# EAGLE design Schematic_v2 (EAGLE 9.4.0)
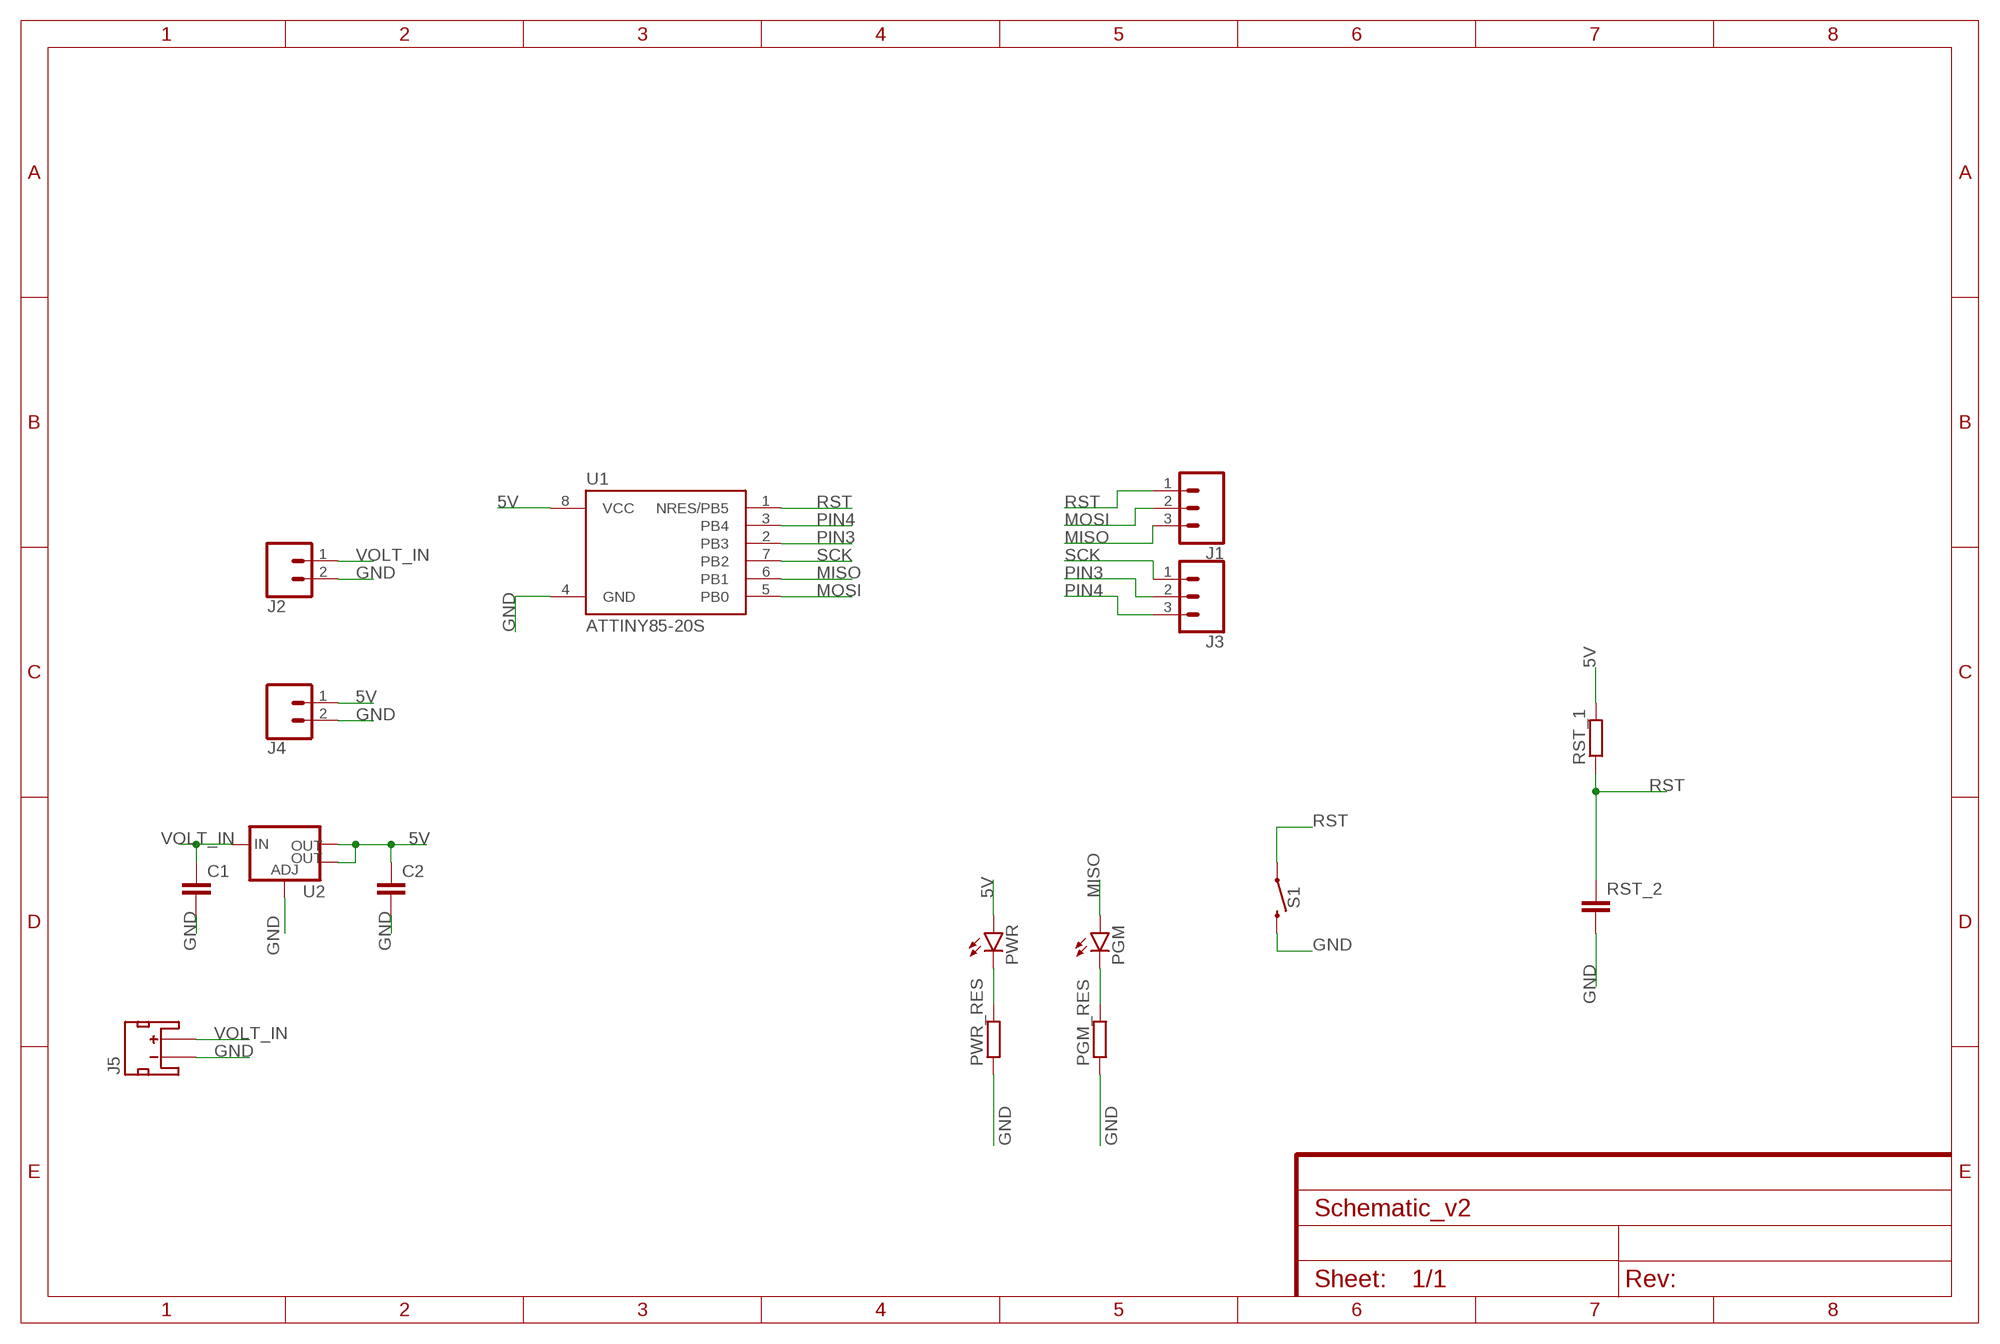
[diagram p0: schematic, sheet 1]

## Parts
C1  C-EUC0805  [C0805]
C2  C-EUC0805  [C0805]
J1  CONN_031X03_NO_SILK  [1X03_NO_SILK]
J2  CONN_021X02_NO_SILK  [1X02_NO_SILK]
J3  CONN_031X03_NO_SILK  [1X03_NO_SILK]
J4  CONN_021X02_NO_SILK  [1X02_NO_SILK]
J5  JST_2MM_MALE  [JST-2-SMD]
PGM  LEDSML0805  [SML0805]
PGM_RES  R-EU_R0805  [R0805]
PWR  LEDSML0805  [SML0805]
PWR_RES  R-EU_R0805  [R0805]
RST_1  R-EU_R0805  [R0805]
RST_2  C-EUC0805  [C0805]
S1  MOMENTARY-SWITCH-SPST-SMD-6.0X3.5MM  [TACTILE_SWITCH_SMD_6.0X3.5MM]
U1  ATTINY85-20S  [SOIC8_EIAJ_208MIL]
U2  V_REG_LM1117SOT223  [SOT223]

## Nets
5V: C2.1 J4.1 PWR.A RST_1.2 U1.8(VCC) U2.2(OUT) U2.4(OUT)
GND: C1.2 C2.2 J2.2 J4.2 J5.1(-) PGM_RES.1 PWR_RES.1 RST_2.2 S1.2 U1.4(GND) U2.1(ADJ)
MISO: J1.3 PGM.A U1.6(PB1)
MOSI: J1.2 U1.5(PB0)
N$1: PWR.C PWR_RES.2
N$3: PGM.C PGM_RES.2
PIN3: J3.2 U1.2(PB3)
PIN4: J3.3 U1.3(PB4)
RST: J1.1 RST_1.1 RST_2.1 S1.1 U1.1(NRES/PB5)
SCK: J3.1 U1.7(PB2)
VOLT_IN: C1.1 J2.1 J5.2(+) U2.3(IN)
Unconnected: J5.NC1(PAD1) J5.NC2(PAD2)

## Library data of the parts
C1 C2 RST_2 = rcl:C-EU: CAPACITOR, European symbol; SPICEPREFIX: C
J1 J3 = SparkFun-Connectors:CONN_03: Multi connection point. Often used as Generic Header-pin footprint for 0.1 inch spaced/style header connections On any of the 0.1 inch spaced packages, you can populate with these: Break Away Headers - Straight <https://www.sparkfun.com/products/116> (PRT-00116) Break Away Male Headers - Right Angle <https://www.sparkfun.com/products/553> (PRT-00553) Female Headers <https://www.sparkfun.com/products/115> (PRT-00115) Break Away Headers - Machine Pin <https://www.sparkfun.com/products/117> (PRT-00117) Break Away Female Headers - Swiss Machine Pin <https://www.sparkfun.com/products/743> (PRT-00743) Stackable Header - 3 Pin (Female, 0.1") <https://www.sparkfun.com/products/13875> (PRT-13875) For SCREWTERMINALS and SPRING TERMINALS visit here: Screw Terimnals on SparkFun.com <https://www.sparkfun.com/search/results?term=Screw+Terminals> (5mm/3.5mm/2.54mm spacing) This device is also useful as a general connection point to wire up your design to another part of your project. Our various solder wires solder well into these plated through hole pads. Hook-Up Wire - Assortment (Stranded, 22 AWG) <https://www.sparkfun.com/products/11375> (PRT-11375) Hook-Up Wire - Assortment (Solid Core, 22 AWG) <https://www.sparkfun.com/products/11367> (PRT-11367) View the entire wire category on our website here <https://www.sparkfun.com/categories/141> Special notes: Molex polarized connector foot print use with SKU : PRT-08232 with associated crimp pins and housings.
J2 J4 = SparkFun-Connectors:CONN_02: Multi connection point. Often used as Generic Header-pin footprint for 0.1 inch spaced/style header connections On any of the 0.1 inch spaced packages, you can populate with these: Break Away Headers - Straight <https://www.sparkfun.com/products/116> (PRT-00116) Break Away Male Headers - Right Angle <https://www.sparkfun.com/products/553> (PRT-00553) Female Headers <https://www.sparkfun.com/products/115> (PRT-00115) Break Away Headers - Machine Pin <https://www.sparkfun.com/products/117> (PRT-00117) Break Away Female Headers - Swiss Machine Pin <https://www.sparkfun.com/products/743> (PRT-00743) For SCREWTERMINALS and SPRING TERMINALS visit here: Screw Terimnals on SparkFun.com <https://www.sparkfun.com/search/results?term=Screw+Terminals> (5mm/3.5mm/2.54mm spacing) This device is also useful as a general connection point to wire up your design to another part of your project. Our various solder wires solder well into these plated through hole pads. Hook-Up Wire - Assortment (Stranded, 22 AWG) <https://www.sparkfun.com/products/11375> (PRT-11375) Hook-Up Wire - Assortment (Solid Core, 22 AWG) <https://www.sparkfun.com/products/11367> (PRT-11367) View the entire wire category on our website here <https://www.sparkfun.com/categories/141> Special notes: Molex polarized connector foot print use with: PRT-08233 with associated crimp pins and housings. 2.54_SCREWTERM for use with PRT-10571. 3.5mm Screw Terminal footprints for PRT-08084 5mm Screw Terminal footprints for use with PRT-08432
J5 = SparkFun-Connectors:JST_2MM_MALE: JST 2MM MALE RA CONNECTOR Two pin, compact surface mount connector. Commonly used as a battery input connection point. We really like the solid locking feeling and high current rating on these small connectors. We use these all the time as battery connectors. Mates to single-cell LiPo batteries. Here is the connector we sell at SparkFun: JST Right Angle Connector - White <https://www.sparkfun.com/products/8612> (PRT-08612) Datasheet <http://www.sparkfun.com/datasheets/Prototyping/Connectors/JST-Horizontal.pdf> It was used on these SparkFun products: SparkFun MOSFET Power Controller <https://www.sparkfun.com/products/11214> (PRT-11214) SparkFun Battery Babysitter - LiPo Battery Manager <https://www.sparkfun.com/products/13777> (PRT-13777) And many, many others that required a lipo battery connection.; PROD_ID: CONN-11443; SF_ID: PRT-08612
PGM PWR = led:LED: LED OSRAM: - CHIPLED LG R971, LG N971, LY N971, LG Q971, LY Q971, LO R971, LY R971 LH N974, LH R974 LS Q976, LO Q976, LY Q976 LO Q996 - Hyper CHIPLED LW Q18S LB Q993, LB Q99A, LB R99A - SideLED LS A670, LO A670, LY A670, LG A670, LP A670 LB A673, LV A673, LT A673, LW A673 LH A674 LY A675 LS A676, LA A676, LO A676, LY A676, LW A676 LS A679, LY A679, LG A679 - Hyper Micro SIDELED® LS Y876, LA Y876, LO Y876, LY Y876 LT Y87S - SmartLED LW L88C, LW L88S LB L89C, LB L89S, LG L890 LS L89K, LO L89K, LY L89K LS L896, LA L896, LO L896, LY L896 - TOPLED LS T670, LO T670, LY T670, LG T670, LP T670 LSG T670, LSP T670, LSY T670, LOP T670, LYG T670 LG T671, LOG T671, LSG T671 LB T673, LV T673, LT T673, LW T673 LH T674 LS T676, LA T676, LO T676, LY T676, LB T676, LH T676, LSB T676, LW T676 LB T67C, LV T67C, LT T67C, LS T67K, LO T67K, LY T67K, LW E67C LS E67B, LA E67B, LO E67B, LY E67B, LB E67C, LV E67C, LT E67C LW T67C LS T679, LY T679, LG T679 LS T770, LO T770, LY T770, LG T770, LP T770 LB T773, LV T773, LT T773, LW T773 LH T774 LS E675, LA E675, LY E675, LS T675 LS T776, LA T776, LO T776, LY T776, LB T776 LHGB T686 LT T68C, LB T68C - Hyper Mini TOPLED® LB M676 - Mini TOPLED Santana® LG M470 LS M47K, LO M47K, LY M47K Source: http://www.osram.convergy.de LUXEON: - LUMILED® LXK2-PW12-R00, LXK2-PW12-S00, LXK2-PW14-U00, LXK2-PW14-V00 LXK2-PM12-R00, LXK2-PM12-S00, LXK2-PM14-U00 LXK2-PE12-Q00, LXK2-PE12-R00, LXK2-PE12-S00, LXK2-PE14-T00, LXK2-PE14-U00 LXK2-PB12-K00, LXK2-PB12-L00, LXK2-PB12-M00, LXK2-PB14-N00, LXK2-PB14-P00, LXK2-PB14-Q00 LXK2-PR12-L00, LXK2-PR12-M00, LXK2-PR14-Q00, LXK2-PR14-R00 LXK2-PD12-Q00, LXK2-PD12-R00, LXK2-PD12-S00 LXK2-PH12-R00, LXK2-PH12-S00 LXK2-PL12-P00, LXK2-PL12-Q00, LXK2-PL12-R00 Source: www.luxeon.com KINGBRIGHT: KA-3528ASYC Source: www.kingbright.com
PGM_RES PWR_RES RST_1 = rcl:R-EU_: RESISTOR, European symbol; SPICEPREFIX: R
S1 = SparkFun-Switches:MOMENTARY-SWITCH-SPST: Momentary Switch (Pushbutton) - SPST Normally-open (NO) SPST momentary switches (buttons, pushbuttons). Variants PTH-12MM - 12mm square, through-hole Momentary Pushbutton Switch - 12mm Square <https://www.sparkfun.com/products/9190> (COM-09190) PTH-6.0MM, PTH-6.0MM-KIT - 6.0mm square, through-hole Mini Pushbutton Switch <https://www.sparkfun.com/products/97> (COM-00097) KIT package intended for soldering kit's - only one side of pads' copper is exposed. PTH-RIGHT-ANGLE-KIT - Right-angle, through-hole Right Angle Tactile Button <https://www.sparkfun.com/products/10791> - Used on SparkFun BigTime Watch Kit <https://www.sparkfun.com/products/11734> SMD-12MM - 12mm square, surface-mount Tactile Button - SMD (12mm) <https://www.sparkfun.com/products/12993> (COM-12993) Used on SparkFun PicoBoard <https://www.sparkfun.com/products/11888> SMD-4.5MM - 4.5mm Square Trackball Switch Used on SparkFun Blackberry Trackballer Breakout <https://www.sparkfun.com/products/13169> SMD-4.6MMX2.8MM - 4.60mm x 2.80mm, surface mount Used on SparkFun SAMD21 Mini Breakout <https://www.sparkfun.com/products/13664> SMD-5.2MM, SMD-5.2-REDUNDANT - 5.2mm square, surface-mount Mini Pushbutton Switch - SMD <https://www.sparkfun.com/products/8720> (COM-08720) Used on Arduino Pro Mini <https://www.sparkfun.com/products/11114> REDUNDANT package connects both switch circuits together SMD-6.0X3.5MM - 6.0 x 3.5mm, surface mount Momentary Reset Switch SMD <https://www.sparkfun.com/products/8229> (COM-08229) SMD-6.2MM-TALL - 6.2mm square, surface mount Tactile Button - SMD (6mm) <https://www.sparkfun.com/products/12992> Used on SparkFun Digital Sandbox <https://www.sparkfun.com/products/12651> SMD-RIGHT-ANGLE - Right-angle, surface mount Used on SparkFun Block for Intel® Edison - Arduino <https://www.sparkfun.com/products/13036>; PROD_ID: SWCH-00815; SF_SKU: COM-08229
U1 = _hhn_attiny25_45_85:ATTINY85*: ATMEL ATtiny 85 Packages: P = PDIP 08 30mil S = SOIC 08 EIAJ 208mil Technologies Note: for complete ordering code (temp. range, finish, tape&reel etc.) see www.atmel.com • Supply Voltage: V = (1.8…5.5)V | [blank] = (2.7…5.5)V • Speed: 10 = 10 MHz | 20 = 20 MHz Author: Dipl.-Ing. FH Rainer Bayer HHN Hochschule Heilbronn (Heilbronn University), rainer.bayer@hs-heilbronn.de Ingenieurbüro ing-rb, mail@ing-rb.de
U2 = SparkFun-IC-Power:V_REG_LM1117: Voltage Regulator LM1117 Standard adjustable voltage regulator but in SMD form. Spark Fun Electronics SKU : COM-00595; PROD_ID: VREG-08170

## Board
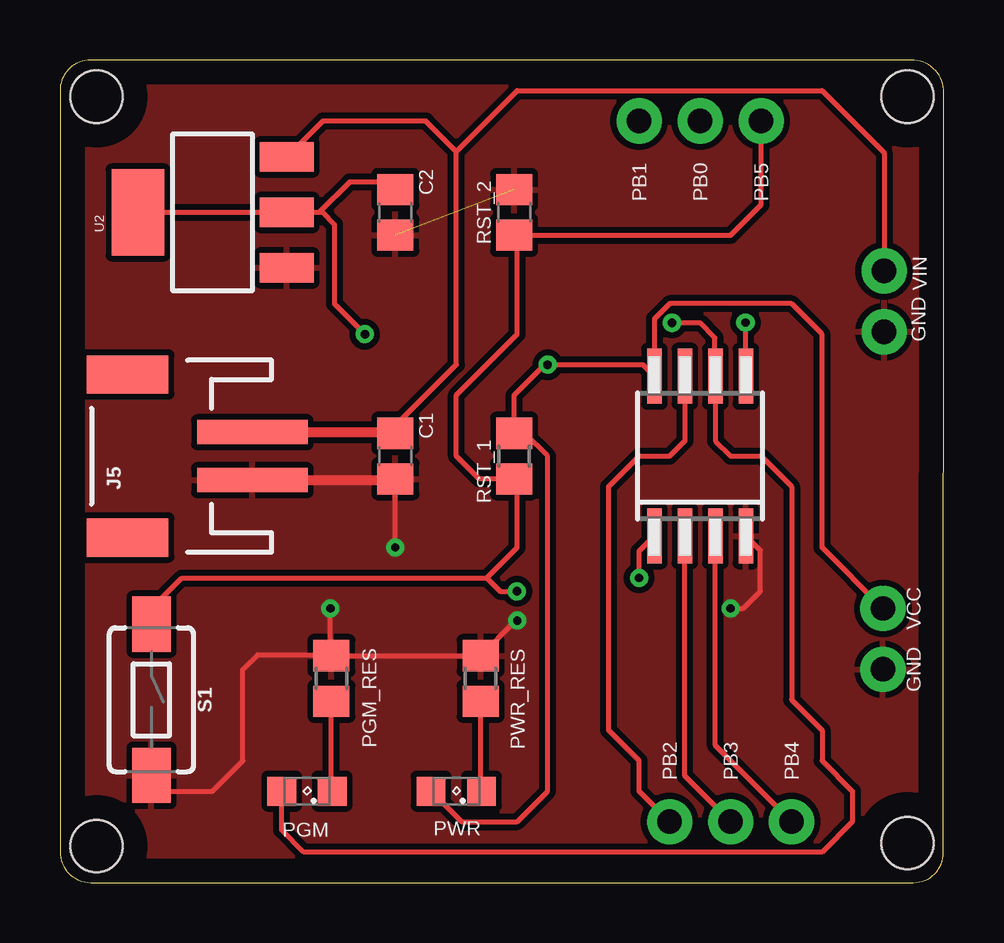
[diagram p1: board, top side]
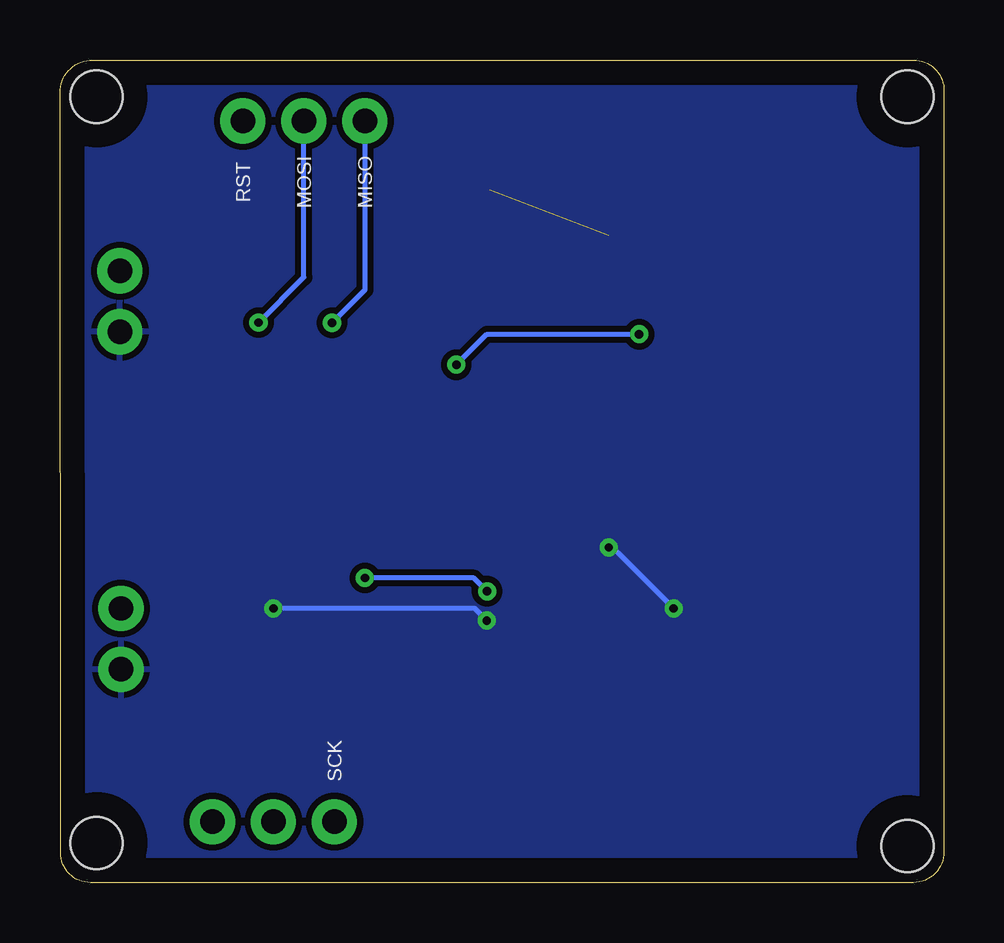
[diagram p2: board, bottom side, seen from below]

Size 36.83 x 34.29 mm. Coordinates in mm from the lower left corner, seen from the top.
Outline: 0,33 0,1.29 arc90 1.28,0 35.56,0 arc90 36.81,1.25 36.83,32.94 arc90 35.48,34.29 1.27,34.29 arc91 0,33
Copper layers (1*16): Top 0.035mm / dielectric 1.5mm / Bottom 0.035mm
Design rules "default": minimum track width 6mil, minimum drill 0.35mm, track to track 6mil, track to pad 6mil, pad to pad 6mil, via to via 6mil, smd to smd 6mil, copper to edge 40mil, drill to drill 6mil, minimum pad ring 10mil, minimum via ring 8mil, stop-mask expansion 4mil, vias tented up to drill 0mil, thermal gap 10mil
Holes 2.18 mm at 1.52,32.76 35.31,32.77 35.31,1.65 1.52,1.52

### Footprints (pad centres in the part's own frame; a part is rotated, then mirrored left to right if it is on the bottom)
C0805 = smd 1.3 x 1.5: 1 -0.95,0; 2 0.95,0
1X03_NO_SILK = drill 1.016 pad 1.88: 1 0,0; 2 2.54,0; 3 5.08,0
1X02_NO_SILK = drill 1.016 pad 1.88: 1 0,0; 2 2.54,0
JST-2-SMD = smd 1 x 4.6: 1 -1,-3.7; 2 1,-3.7 | smd 1.6 x 3.4: NC1 -3.4,1.5; NC2 3.4,1.5
SML0805 = smd 1.2 x 1.2: A 1.05,0; C -1.05,0
R0805 = smd 1.3 x 1.5: 1 -0.95,0; 2 0.95,0
TACTILE_SWITCH_SMD_6.0X3.5MM = smd 2.3 x 1.6: 1 -3.15,0; 2 3.15,0
SOIC8_EIAJ_208MIL = smd 0.6 x 2.286: 1 -1.905,-3.33; 2 -0.635,-3.33; 3 0.635,-3.33; 4 1.905,-3.33; 5 1.905,3.33; 6 0.635,3.33; 7 -0.635,3.33; 8 -1.905,3.33
SOT223 = smd 1.219 x 2.235: 1 -2.311,-3.099; 2 0,-3.099; 3 2.311,-3.099 | smd 3.6 x 2.2: 4 0,3.099

### Placement (x,y rotation side)
C1  13.97,17.78 270 top
C2  13.97,27.94 270 top
J1  29.21,31.75 180 top
J2  34.34,25.5 270 top
J3  25.4,2.54 0 top
J4  34.29,11.43 270 top
J5  4.32,17.78 90 top
PGM  10.29,3.81 180 top
PGM_RES  11.3,8.51 270 top
PWR  16.51,3.81 180 top
PWR_RES  17.53,8.51 270 top
RST_1  18.92,17.78 90 top
RST_2  18.92,27.94 90 top
S1  3.81,7.62 270 top
U1  26.67,17.78 0 top
U2  6.35,27.94 90 top

### Tracks (layer width: path | path; a pad name or v marks a point on that pad's centre or on a via)
5V  (via drill 0.35)
  Top 0.2: C2.1 13.65,29.21 12.07,29.21 10.8,27.94 | v12.7,22.86 11.43,24.13 11.43,27.43 10.92,27.94 10.8,27.94 | J4.1 31.75,13.97 31.75,22.86 30.48,24.13 25.4,24.13 24.77,23.5 U1.8 24.29,21.59 v20.32,21.59 20.19,21.59 18.92,20.32 RST_1.2 19.37,18.73 20.32,17.78 20.32,3.81 19.05,2.54 16.73,2.54 PWR.A | U2.4 U2.2 10.8,27.94
  Bottom 0.2: v20.32,21.59 19.05,22.86 v12.7,22.86
GND  (via drill 0.35)  (1 unrouted)
  Top 0.2: 11.26,9.5 PGM_RES.1 PWR_RES.1 18.99,10.93 v19.05,10.93 | 11.26,9.5 v11.26,11.43 | v13.97,13.97 C1.2 | v27.94,11.43 28.46,11.43 29.18,12.14 29.18,13.85 U1.4 | S1.2 4.47,3.81 6.35,3.81 7.62,5.08 7.62,8.89 8.23,9.5 11.26,9.5
  Top 0.406: J5.1 13.92,16.78 C1.2
  Bottom 0.2: v11.26,11.43 13.8,13.97 v13.97,13.97 | v19.05,10.93 19.56,11.43 v27.94,11.43
  pour Top (isolate 0.254): 0,17.78 0,1.27 arc90 1.27,0 35.56,0 arc90 36.83,1.27 36.83,33.02 arc90 35.56,34.29 1.27,34.29 arc90 0,33.02
  pour Bottom (isolate 0.254): 0,17.78 0,1.27 arc90 1.27,0 35.56,0 arc90 36.83,1.27 36.83,33.02 arc90 35.56,34.29 1.27,34.29 arc90 0,33.02
MISO  (via drill 0.35)
  Top 0.2: PGM.A 9.24,2.19 10.16,1.27 31.75,1.27 33.02,2.54 33.02,3.81 31.75,5.08 31.75,6.35 30.48,7.62 30.48,16.51 29.21,17.78 27.94,17.78 27.31,18.41 U1.6 27.29,21.12 27.29,22.72 26.67,23.34 v25.5,23.34
  Bottom 0.2: J1.3 24.13,24.7 v25.5,23.34
MOSI  (via drill 0.35)
  Top 0.2: U1.5 28.58,23.33 v28.56,23.35
  Bottom 0.2: v28.56,23.35 26.67,25.24 J1.2
N$1
  Top 0.2: PWR.C 17.53,3.84 PWR_RES.2
N$3
  Top 0.2: PGM.C 11.3,3.84 PGM_RES.2
PIN3
  Top 0.2: J3.2 26.04,4.45 U1.2
PIN4
  Top 0.2: J3.3 27.31,5.71 U1.3
RST  (via drill 0.35)
  Top 0.2: J1.1 29.21,28.26 27.94,26.99 RST_2.1 19.05,26.86 19.05,22.86 16.51,20.32 16.51,17.78 17.46,16.83 RST_1.1 19.05,16.7 19.05,13.97 17.78,12.7 | 17.78,12.7 18.34,12.14 v19.04,12.14 | v24.13,12.7 24.13,13.81 U1.1 | S1.1 3.81,11.43 5.08,12.7 17.78,12.7
  Bottom 0.2: v19.04,12.14 19.59,12.7 v24.13,12.7
SCK
  Top 0.2: J3.1 24.13,3.81 24.13,5.08 22.86,6.35 22.86,16.51 24.13,17.78 25.4,17.78 26.05,18.43 26.05,20.32 26.05,20.47 26.05,21.1 U1.7
VOLT_IN
  Top 0.2: C1.1 13.97,19.05 16.51,21.59 16.51,30.48 | 16.51,30.48 15.24,31.75 10.95,31.75 U2.3 | 16.51,30.48 19.05,33.02 31.75,33.02 34.34,30.43 J2.1
  Top 0.406: J5.2 13.92,18.78 C1.1

### Text on the board
tPlace: PB1 | PB0 | PB5 | VIN | GND | VCC | GND | PB2 | PB3 | PB4
bPlace: MISO | MOSI | RST | SCK